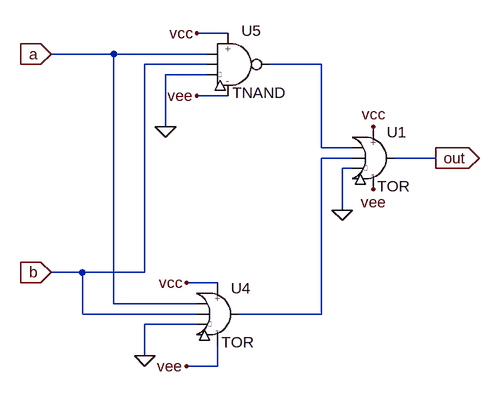
[diagram p0: schematic TXOR.asc]
TXOR.asc, the LTspice schematic file:
Version 4
SHEET 1 1556 748
WIRE -352 -352 -400 -352
WIRE -528 -320 -624 -320
WIRE -384 -320 -528 -320
WIRE -384 -304 -480 -304
WIRE -208 -304 -288 -304
WIRE -384 -288 -448 -288
WIRE -352 -256 -400 -256
WIRE -448 -208 -448 -288
WIRE -208 -176 -208 -304
WIRE -160 -176 -208 -176
WIRE -160 -160 -208 -160
WIRE -32 -160 -96 -160
WIRE -160 -144 -176 -144
WIRE -176 -80 -176 -144
WIRE -576 16 -624 16
WIRE -480 16 -480 -304
WIRE -480 16 -576 16
WIRE -368 32 -416 32
WIRE -528 64 -528 -320
WIRE -400 64 -528 64
WIRE -576 80 -576 16
WIRE -400 80 -576 80
WIRE -208 80 -208 -160
WIRE -208 80 -336 80
WIRE -400 96 -480 96
WIRE -480 144 -480 96
WIRE -368 160 -368 128
WIRE -368 160 -416 160
FLAG -624 -320 a
IOPIN -624 -320 In
FLAG -624 16 b
IOPIN -624 16 In
FLAG -32 -160 out
IOPIN -32 -160 Out
FLAG -400 -352 vcc
FLAG -416 32 vcc
FLAG -400 -256 vee
FLAG -416 160 vee
FLAG -128 -208 vcc
FLAG -128 -112 vee
FLAG -448 -208 0
FLAG -480 144 0
FLAG -176 -80 0
SYMBOL TOR -368 80 R0
SYMATTR InstName U4
SYMBOL TNAND -336 -304 R0
SYMATTR InstName U5
SYMBOL TOR -128 -160 R0
SYMATTR InstName U1

The netlist it stands for:
* TXOR.asc
XU4 a b vcc vee N002 0 TOR  ; pins a b vcc vee out gnd
XU5 a b vcc vee N001 0 TNAND  ; pins a b vcc vee out gnd
XU1 N001 N002 vcc vee out 0 TOR  ; pins a b vcc vee out gnd
.lib /Users/manoelribeiroalmeida/dev/trit/LTspice/TOR.sub
.lib /Users/manoelribeiroalmeida/dev/trit/LTspice/TNAND.sub
.backanno
.end